# Altium schematic sheet IR Range.SchDoc
size 420 x 297 mm; Organization: AzekClark; DocumentNumber: StairsLED; SheetNumber: 4; Scale: 1:1; DocumentType: Схема электрическая принципиальная; FirstReferrence: StairsLED
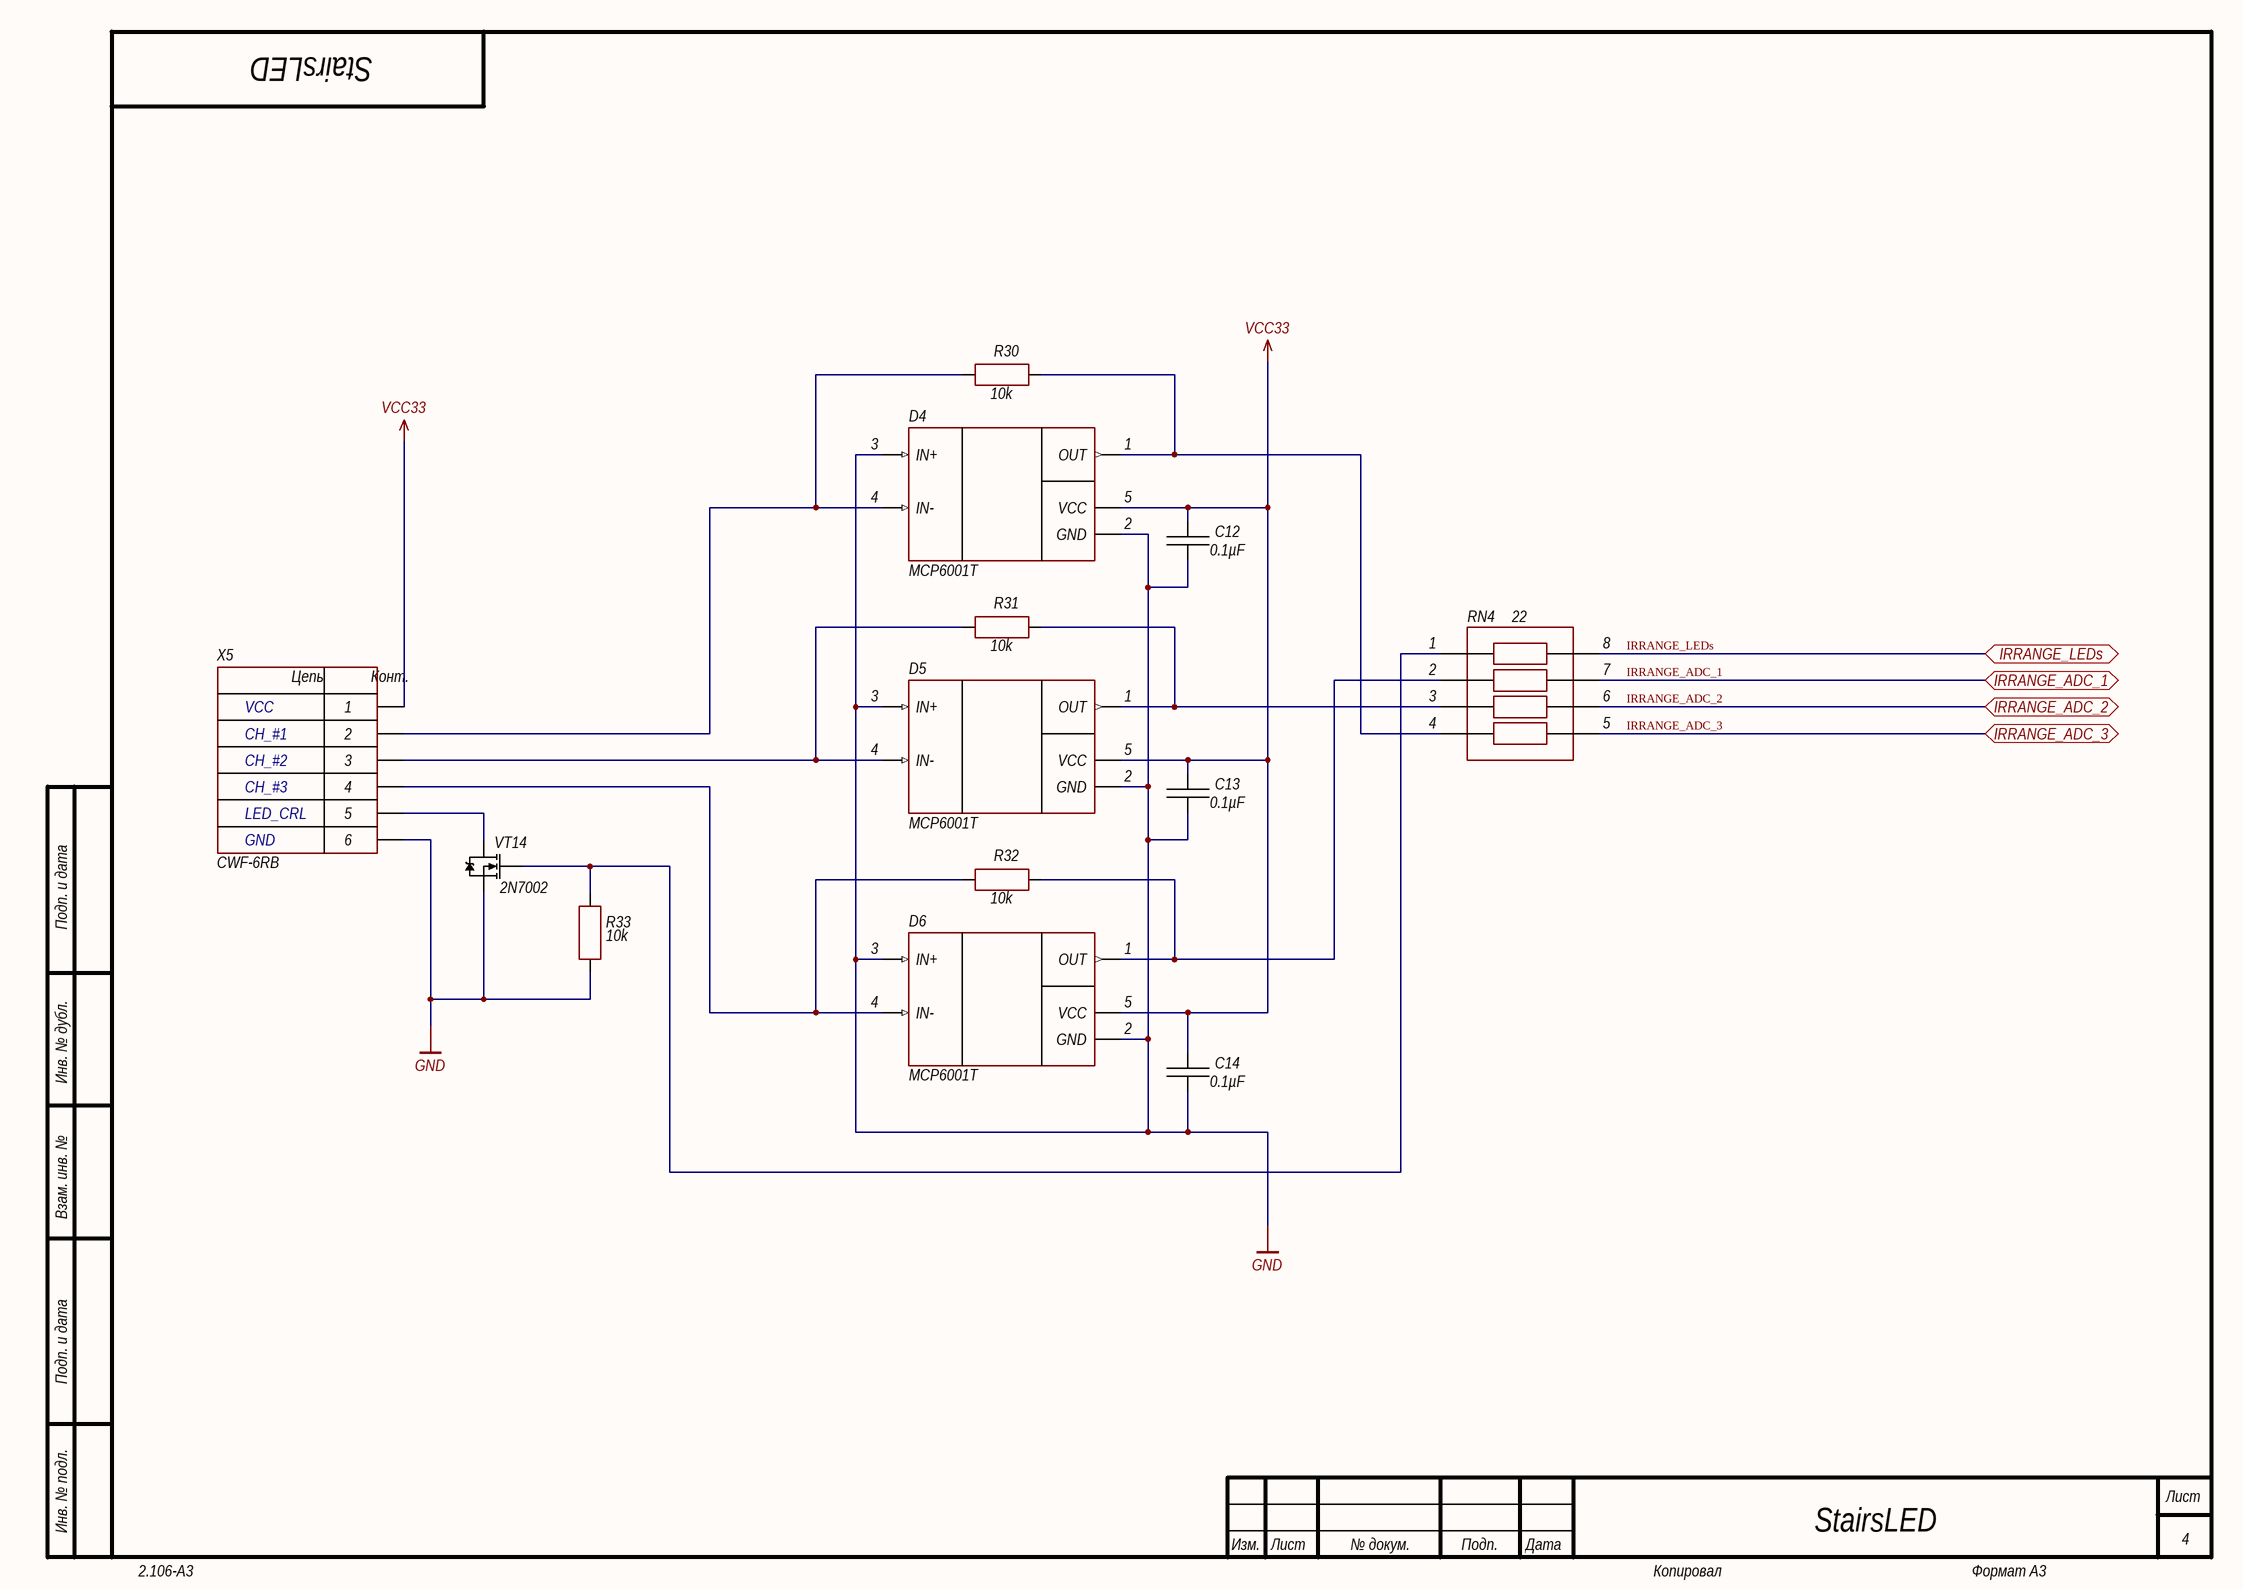
[diagram p0: IR Range.SchDoc]

## Parts
C12  0.1µF  [CH0603C]
C13  0.1µF  [CH0603C]
C14  0.1µF  [CH0603C]
D4  MCP6001T  [SOT23-5]
D5  MCP6001T  [SOT23-5]
D6  MCP6001T  [SOT23-5]
R30  10k  [CH0603R]
R31  10k  [CH0603R]
R32  10k  [CH0603R]
R33  10k  [CH0603R]
RN4  22  [CH0603Rx4 (1206)]
VT14  2N7002  [SOT23_132]
X5  CWF-6RB  [CON: CWF-6RB]

## Ports
IRRANGE_ADC_1 (bidir), IRRANGE_ADC_2 (bidir), IRRANGE_ADC_3 (bidir), IRRANGE_LEDs (bidir)

## Nets
GND: C12.1 C13.1 C14.1 D4.2(GND) D4.3(IN+) D5.2(GND) D5.3(IN+) D6.2(GND) D6.3(IN+) R33.1 VT14.3(S) X5.6
VCC33: C12.2 C13.2 C14.2 D4.5(VCC) D5.5(VCC) D6.5(VCC) X5.1
IRRANGE_ADC_1: RN4.7 ; port IRRANGE_ADC_1
IRRANGE_ADC_2: RN4.6 ; port IRRANGE_ADC_2
IRRANGE_ADC_3: RN4.5 ; port IRRANGE_ADC_3
IRRANGE_LEDs: RN4.8 ; port IRRANGE_LEDs
NetD4_1: D4.1(OUT) R30.2 RN4.4
NetD4_4: D4.4(IN-) R30.1 X5.2
NetD5_1: D5.1(OUT) R31.2 RN4.3
NetD5_4: D5.4(IN-) R31.1 X5.3
NetD6_1: D6.1(OUT) R32.2 RN4.2
NetD6_4: D6.4(IN-) R32.1 X5.4
NetR33_2: R33.2 RN4.1 VT14.1(G)
NetVT14_2: VT14.2(D) X5.5

## Notes on the sheet
- VCC
- CH_#1
- CH_#2
- CH_#3
- GND
- LED_CRL
- Подп. и дата
- Инв. № дубл.
- Взам. инв. №
- Инв. № подл.
- Изм.
- Лист
- № докум.
- Подп.
- Дата
- 2.106-A3
- Копировал
- Формат А3
- (in symbol 6-Connector) Цепь; Конт.

## Library data of the parts
C12-C14 = Capacitor: Manufacturer: *; Model: *; HelpURL: *; ComponentKind: *; Value: 0.1µF
D4-D6 = MCP6001T: OP amplifier; Manufacturer: Microchip Technology; Model: MCP6001T-I/OT; HelpURL: https://www.digikey.com/product-detail/en/microchip-technology/MCP6001T-I-OT/MCP6001T-I-OTCT-ND/697158; ComponentKind: SOT23-5
R30-R33 = Resistor: Manufacturer: *; Model: *; HelpURL: *; ComponentKind: *; Value: 10k
RN4 = Resistor assembly: Manufacturer: Bourns GmbH.; Model: CAT16-J4; HelpURL: https://www.terraelectronica.ru/pdf/show?pdf_file=https%253A%252F%252Fwww.mouser.com%252Fds%252F2%252F54%252FATCAY-777361.pdf; ComponentKind: *; Value: 22
VT14 = N-chanel: Mosfet; Manufacturer: ON Semiconductor; Model: 2N7002; ComponentKind: 0.2А, 60В; HelpURL: https://static.chipdip.ru/lib/318/DOC000318735.pdf
X5 = 6-Connector: Model: CWF-6RB; Manufacturer: *; HelpURL: *; ComponentKind: *